# Altium schematic sheet Endurence.SchDoc
size A3
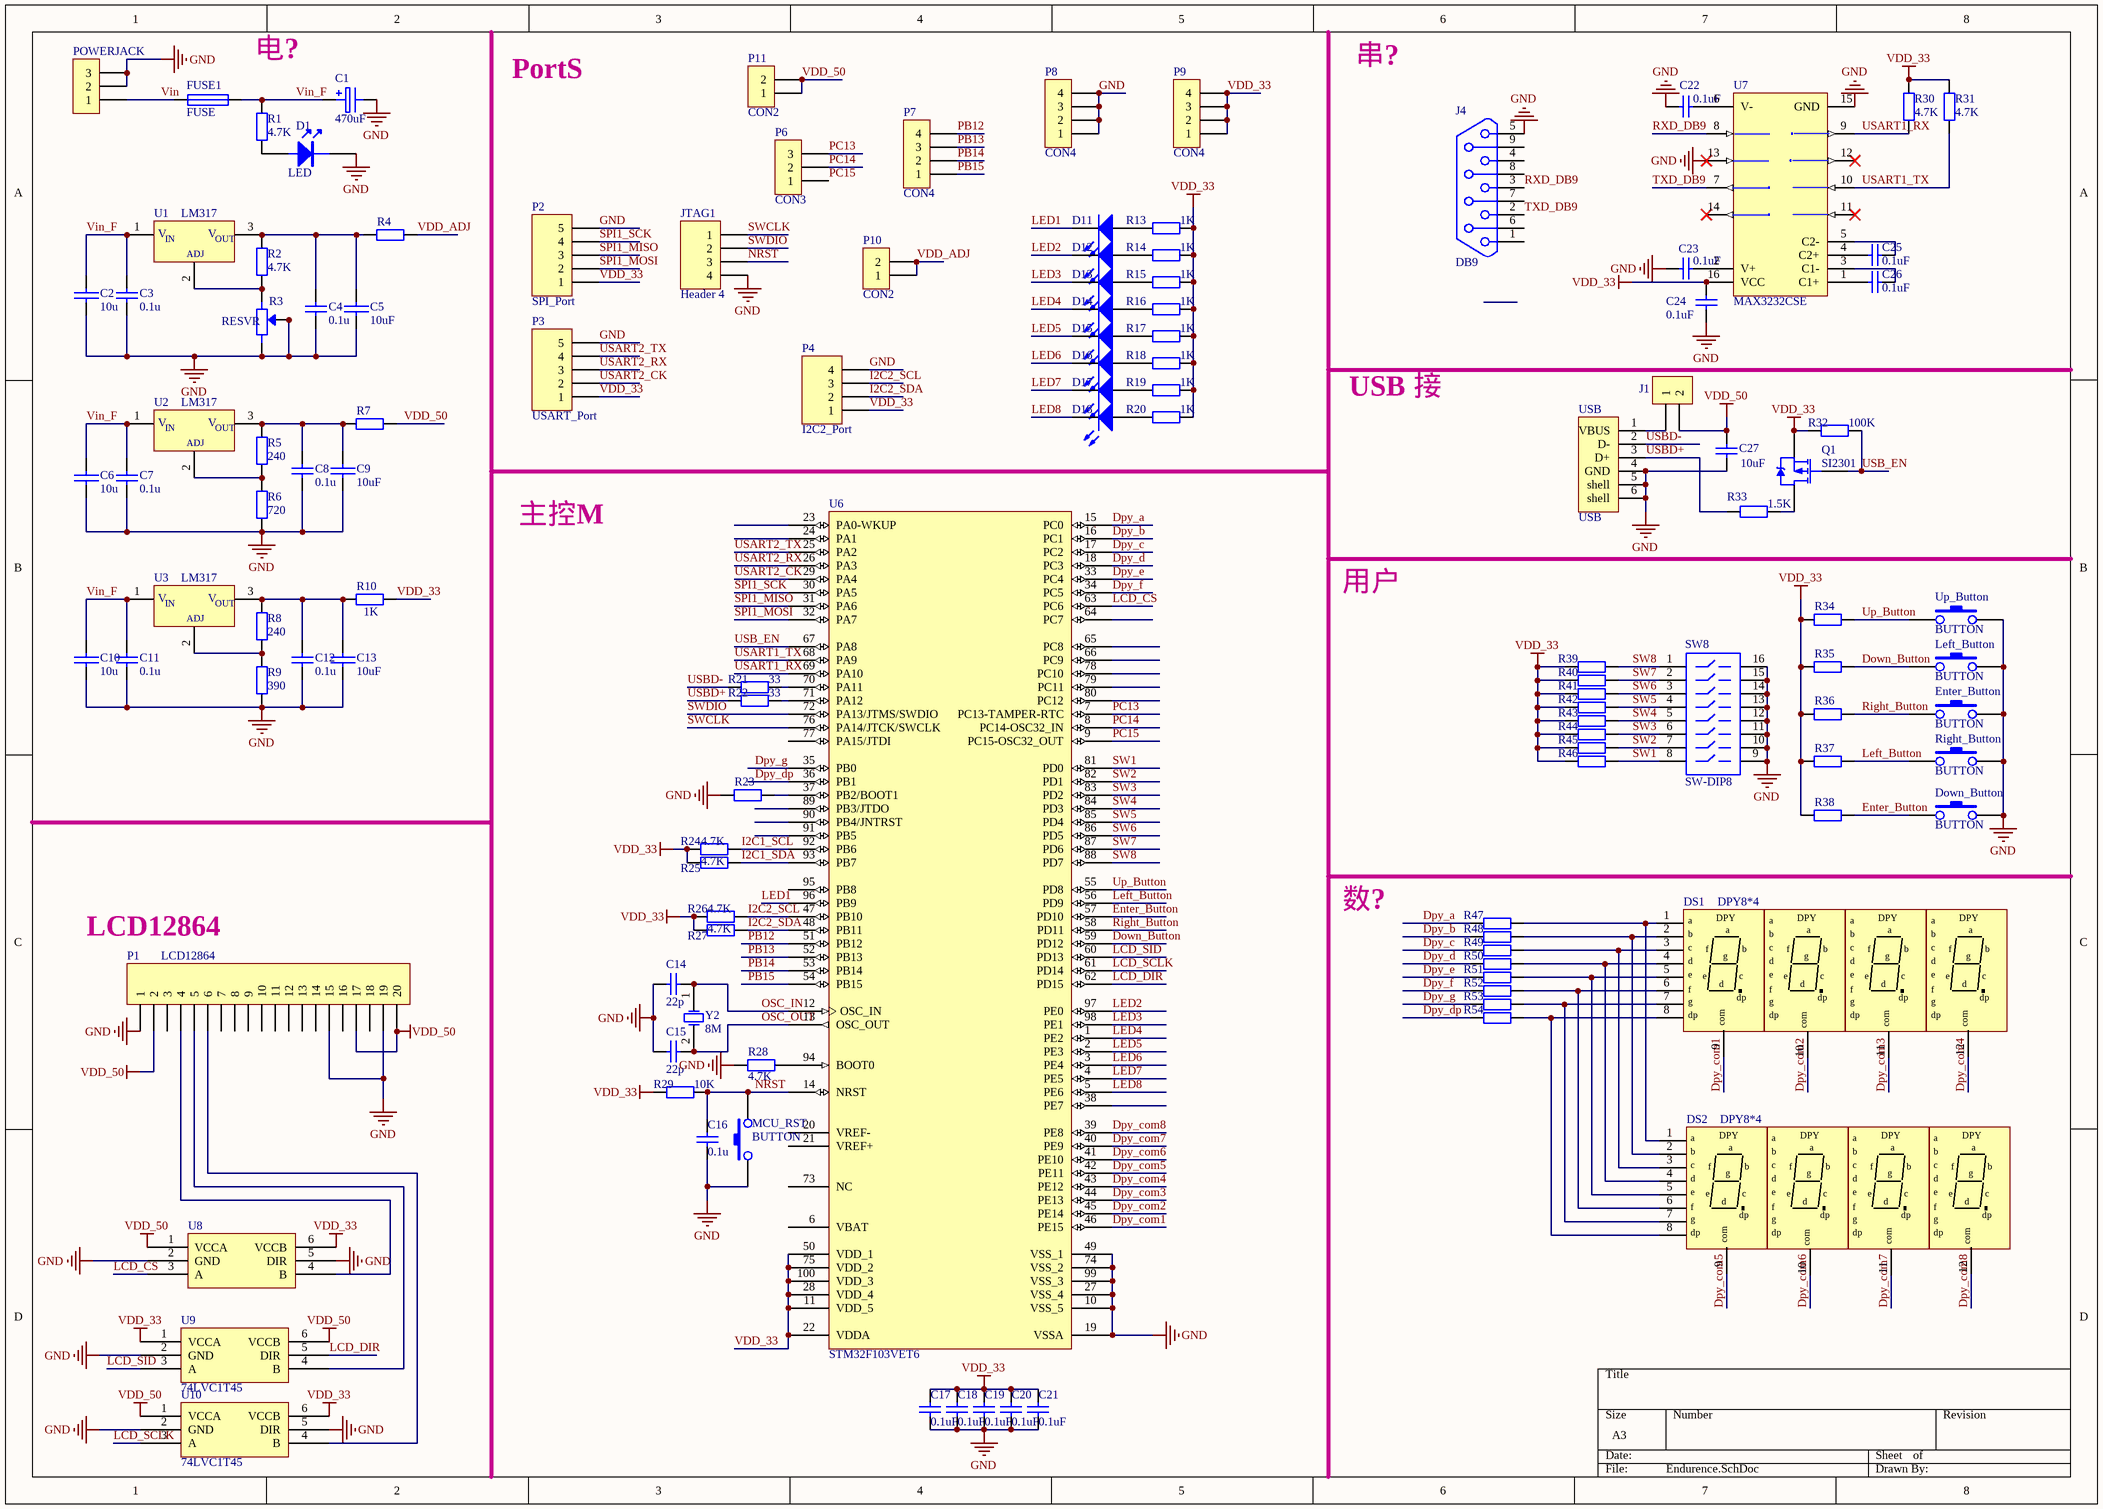
[diagram p0: Endurence.SchDoc]

## Parts
C1  470uF  [MYRB.2/.4]
C2  10u  [0805]
C3  value 0.1u  [0805]  (hidden comment: 0.1uF)
C4  value 0.1u  [0805]  (hidden comment: 0.1uF)
C5  10uF  [0805]
C6  10u  [0805]
C7  value 0.1u  [0805]  (hidden comment: 0.1uF)
C8  value 0.1u  [0805]  (hidden comment: 0.1uF)
C9  10uF  [0805]
C10  10u  [0805]
C11  value 0.1u  [0805]  (hidden comment: 0.1uF)
C12  value 0.1u  [0805]  (hidden comment: 0.1uF)
C13  10uF  [0805]
C14  value 22p  [0805]  (hidden comment: 20pF)
C15  value 22p  [0805]  (hidden comment: 20pF)
C16  value 0.1u  [0805]  (hidden comment: 0.1uF)
C17  0.1uF  [0805]
C18  0.1uF  [0805]
C19  0.1uF  [0805]
C20  0.1uF  [0805]
C21  0.1uF  [0805]
C22  0.1uF  [0805]
C23  0.1uF  [0805]
C24  0.1uF  [0805]
C25  0.1uF  [0805]
C26  0.1uF  [0805]
C27  10uF  [0805]
D1  LED  [0805]
D11  LED2  [0805]  (value not drawn)
D12  LED2  [0805]  (value not drawn)
D13  LED2  [0805]  (value not drawn)
D14  LED2  [0805]  (value not drawn)
D15  LED2  [0805]  (value not drawn)
D16  LED2  [0805]  (value not drawn)
D17  LED2  [0805]  (value not drawn)
D18  LED2  [0805]  (value not drawn)
Down_Button  BUTTON  [BUTTON-S]
DS1  DPY8*4  [DYP8*4]
DS2  DPY8*4  [DYP8*4]
Enter_Button  BUTTON  [BUTTON-S]
FUSE1  FUSE  [FUSE]
J1  CON2  [SIP2]  (value not drawn)
J4  DB9  [DB9]
JTAG1  Header 4  [HDR1X4]
Left_Button  BUTTON  [BUTTON-S]
MCU_RST  BUTTON  [BUTTON-S]
P1  LCD12864  [LCD12864]
P2  SPI_Port  [HDR1X5]
P3  USART_Port  [HDR1X5]
P4  I2C2_Port  [HDR1X4]
P6  CON3  [SIP3]
P7  CON4  [SIP4]
P8  CON4  [SIP4]
P9  CON4  [SIP4]
P10  CON2  [SIP2]
P11  CON2  [SIP2]
POWERJACK  CON3  [POWERJACK]  (value not drawn)
Q1  SI2301  [SOT-23-2301]
R1  4.7K  [0805]
R2  4.7K  [0805]
R3  RESVR  [SIP3]
R4  1K  [0805]  (value not drawn)
R5  240  [0805]
R6  720  [0805]
R7  1K  [0805]  (value not drawn)
R8  240  [0805]
R9  390  [0805]
R10  1K  [0805]
R13  1K  [0805]
R14  1K  [0805]
R15  1K  [0805]
R16  1K  [0805]
R17  1K  [0805]
R18  1K  [0805]
R19  1K  [0805]
R20  1K  [0805]
R21  33  [0805]
R22  33  [0805]
R23  4.7K  [0805]  (value not drawn)
R24  4.7K  [0805]
R25  4.7K  [0805]
R26  4.7K  [0805]
R27  4.7K  [0805]
R28  4.7K  [0805]
R29  10K  [0805]
R30  4.7K  [0805]
R31  4.7K  [0805]
R32  100K  [0805]
R33  1.5K  [0805]
R34  4.7K  [0805]  (value not drawn)
R35  4.7K  [0805]  (value not drawn)
R36  4.7K  [0805]  (value not drawn)
R37  4.7K  [0805]  (value not drawn)
R38  4.7K  [0805]  (value not drawn)
R39  4.7K  [0805]  (value not drawn)
R40  4.7K  [0805]  (value not drawn)
R41  4.7K  [0805]  (value not drawn)
R42  4.7K  [0805]  (value not drawn)
R43  4.7K  [0805]  (value not drawn)
R44  4.7K  [0805]  (value not drawn)
R45  4.7K  [0805]  (value not drawn)
R46  4.7K  [0805]  (value not drawn)
R47  1K  [0805]  (value not drawn)
R48  1K  [0805]  (value not drawn)
R49  1K  [0805]  (value not drawn)
R50  1K  [0805]  (value not drawn)
R51  1K  [0805]  (value not drawn)
R52  1K  [0805]  (value not drawn)
R53  1K  [0805]  (value not drawn)
R54  1K  [0805]  (value not drawn)
Right_Button  BUTTON  [BUTTON-S]
SW8  SW-DIP8  [SW8]
U1  LM317  [LM317]
U2  LM317  [LM317]
U3  LM317  [LM317]
U6  STM32F103VET6  [LQFP100]
U7  MAX3232CSE  [SSOP16]
U8  74LVC1T45  [74LVC1T45]  (value not drawn)
U9  74LVC1T45  [74LVC1T45]
U10  74LVC1T45  [74LVC1T45]
Up_Button  BUTTON  [BUTTON-S]
USB  USB  [USB-B]
Y2  8M  [XTAL-0.2]

## Nets
GND: C1.2 C2.2 C3.1 C4.1 C5.2 C6.2 C7.1 C8.1 C9.2 C10.2 C11.1 C12.1 C13.2 C14.2 C15.2 C16.1 C17.1 C18.1 C19.1 C20.1 C21.1 C22.2 C23.2 C24.1 C27.1 D1.2(K) Down_Button.2 Enter_Button.2 J4.5 JTAG1.4 Left_Button.2 MCU_RST.1 P1.1 P1.15 P1.19 P2.5 P3.5 P4.4 P8.1 P8.2 P8.3 P8.4 POWERJACK.2 POWERJACK.3 R3.2 R3.3(W) R6.1 R9.1 R23.2 R28.2 Right_Button.2 SW8.9 SW8.10 SW8.11 SW8.12 SW8.13 SW8.14 SW8.15 SW8.16 U6.10(VSS_5) U6.19(VSSA) U6.27(VSS_4) U6.49(VSS_1) U6.74(VSS_2) U6.99(VSS_3) U7.13(R1IN) U7.15(GND) U8.2(GND) U8.5(DIR) U9.2(GND) U10.2(GND) U10.5(DIR) Up_Button.2 USB.4(GND) USB.5(shell) USB.6(shell)
VDD_33: C17.2 C18.2 C19.2 C20.2 C21.2 C24.2 P2.1 P3.1 P4.1 P9.1 P9.2 P9.3 P9.4 Q1.3(S) R10.2 R13.2 R14.1 R15.2 R16.2 R17.2 R18.1 R19.2 R20.2 R24.2 R25.2 R26.2 R27.2 R29.1 R30.2 R31.2 R32.1 R34.1 R35.1 R36.1 R37.1 R38.1 R39.1 R40.1 R41.1 R42.1 R43.1 R44.1 R45.1 R46.1 U6.11(VDD_5) U6.22(VDDA) U6.28(VDD_4) U6.50(VDD_1) U6.75(VDD_2) U6.100(VDD_3) U7.16(VCC) U8.6(VCCB) U9.1(VCCA) U10.6(VCCB)
VDD_50: C27.2 J1.2 P1.2 P1.17 P1.20 P11.1 P11.2 R7.2 U8.1(VCCA) U9.6(VCCB) U10.1(VCCA)
Down_Button: Left_Button.1 R35.2 U6.59(PD12)
Dpy_a: R47.1 U6.15(PC0)
Dpy_b: R48.1 U6.16(PC1)
Dpy_c: R49.1 U6.17(PC2)
Dpy_com1: DS1.9(com1) U6.46(PE15)
Dpy_com2: DS1.10(com2) U6.45(PE14)
Dpy_com3: DS1.11(com3) U6.44(PE13)
Dpy_com4: DS1.12(com4) U6.43(PE12)
Dpy_com5: DS2.9(com1) U6.42(PE11)
Dpy_com6: DS2.10(com2) U6.41(PE10)
Dpy_com7: DS2.11(com3) U6.40(PE9)
Dpy_com8: DS2.12(com4) U6.39(PE8)
Dpy_d: R50.1 U6.18(PC3)
Dpy_dp: R54.1 U6.36(PB1)
Dpy_e: R51.1 U6.33(PC4)
Dpy_f: R52.1 U6.34(PC5)
Dpy_g: R53.1 U6.35(PB0)
Enter_Button: Down_Button.1 R38.2 U6.57(PD10)
I2C1_SCL: R24.1 U6.92(PB6)
I2C1_SDA: R25.1 U6.93(PB7)
I2C2_SCL: P4.3 R26.1 U6.47(PB10)
I2C2_SDA: P4.2 R27.1 U6.48(PB11)
LCD_CS: U6.63(PC6) U8.3(A)
LCD_DIR: U6.62(PD15) U9.5(DIR)
LCD_SCLK: U6.61(PD14) U10.3(A)
LCD_SID: U6.60(PD13) U9.3(A)
LED1: D11.2(K) U6.96(PB9)
LED2: D12.2(K) U6.97(PE0)
LED3: D13.2(K) U6.98(PE1)
LED4: D14.2(K) U6.1(PE2)
LED5: D15.2(K) U6.2(PE3)
LED6: D16.2(K) U6.3(PE4)
LED7: D17.2(K) U6.4(PE5)
LED8: D18.2(K) U6.5(PE6)
Left_Button: R37.2 Right_Button.1 U6.56(PD9)
NRST: C16.2 JTAG1.3 MCU_RST.2 R29.2 U6.14(NRST)
OSC_IN: C14.1 U6.12(OSC_IN) Y2.1(OSC1)
OSC_OUT: C15.1 U6.13(OSC_OUT) Y2.2(OSC2)
PB12: P7.4 U6.51(PB12)
PB13: P7.3 U6.52(PB13)
PB14: P7.2 U6.53(PB14)
PB15: P7.1 U6.54(PB15)
PC13: P6.3 U6.7(PC13-TAMPER-RTC)
PC14: P6.2 U6.8(PC14-OSC32_IN)
PC15: P6.1 U6.9(PC15-OSC32_OUT)
Right_Button: Enter_Button.1 R36.2 U6.58(PD11)
RXD_DB9: J4.3 U7.8(R2IN)
SPI1_MISO: P2.3 U6.31(PA6)
SPI1_MOSI: P2.2 U6.32(PA7)
SPI1_SCK: P2.4 U6.30(PA5)
SW1: R46.2 SW8.8 U6.81(PD0)
SW2: R45.2 SW8.7 U6.82(PD1)
SW3: R44.2 SW8.6 U6.83(PD2)
SW4: R43.2 SW8.5 U6.84(PD3)
SW5: R42.2 SW8.4 U6.85(PD4)
SW6: R41.2 SW8.3 U6.86(PD5)
SW7: R40.2 SW8.2 U6.87(PD6)
SW8: R39.2 SW8.1 U6.88(PD7)
SWCLK: JTAG1.1 U6.76(PA14/JTCK/SWCLK)
SWDIO: JTAG1.2 U6.72(PA13/JTMS/SWDIO)
TXD_DB9: J4.2 U7.7(T2OUT)
Up_Button: R34.2 U6.55(PD8) Up_Button.1
USART1_RX: R30.1 U6.69(PA10) U7.9(R2OUT)
USART1_TX: R31.1 U6.68(PA9) U7.10(T2IN)
USART2_CK: P3.2 U6.29(PA4)
USART2_RX: P3.3 U6.26(PA3)
USART2_TX: P3.4 U6.25(PA2)
USB_EN: Q1.1(G) R32.2 U6.67(PA8)
USBD+: R22.1 R33.1 USB.3(D+)
USBD-: R21.1 USB.2(D-)
VDD_ADJ: P10.1 P10.2 R4.2
Vin: FUSE1.1 POWERJACK.1
Vin_F: C1.1 C2.1 C3.2 C6.1 C7.2 C10.1 C11.2 FUSE1.2 R1.1 U1.1(VIN) U2.1(VIN) U3.1(VIN)
NetC4_2: C4.2 C5.1 R2.1 R4.1 U1.3(VOUT)
NetC8_2: C8.2 C9.1 R5.1 R7.1 U2.3(VOUT)
NetC12_2: C12.2 C13.1 R8.1 R10.1 U3.3(VOUT)
NetC22_1: C22.1 U7.6(V-)
NetC23_1: C23.1 U7.2(V+)
NetC25_1: C25.1 U7.5(C2-)
NetC25_2: C25.2 U7.4(C2+)
NetC26_1: C26.1 U7.3(C1-)
NetC26_2: C26.2 U7.1(C1+)
NetD1_1: D1.1(A) R1.2
NetD11_1: D11.1(A) R13.1
NetD12_1: D12.1(A) R14.2
NetD13_1: D13.1(A) R15.1
NetD14_1: D14.1(A) R16.1
NetD15_1: D15.1(A) R17.1
NetD16_1: D16.1(A) R18.2
NetD17_1: D17.1(A) R19.1
NetD18_1: D18.1(A) R20.1
NetDS1_1: DS1.1(a) DS2.1(a) R47.2
NetDS1_2: DS1.2(b) DS2.2(b) R48.2
NetDS1_3: DS1.3(c) DS2.3(c) R49.2
NetDS1_4: DS1.4(d) DS2.4(d) R50.2
NetDS1_5: DS1.5(e) DS2.5(e) R51.2
NetDS1_6: DS1.6(f) DS2.6(f) R52.2
NetDS1_7: DS1.7(g) DS2.7(g) R53.2
NetDS1_8: DS1.8(dp) DS2.8(dp) R54.2
NetJ1_1: J1.1 USB.1(VBUS)
NetP1_4: P1.4 U8.4(B)
NetP1_5: P1.5 U9.4(B)
NetP1_6: P1.6 U10.4(B)
NetQ1_2: Q1.2(D) R33.2
NetR2_2: R2.2 R3.1 U1.2(ADJ)
NetR5_2: R5.2 R6.2 U2.2(ADJ)
NetR8_2: R8.2 R9.2 U3.2(ADJ)
NetR21_2: R21.2 U6.70(PA11)
NetR22_2: R22.2 U6.71(PA12)
NetR23_1: R23.1 U6.37(PB2/BOOT1)
NetR28_1: R28.1 U6.94(BOOT0)

Not connected (* = marked no-connect by the designer): J4 1 4 6 7 8 9; P1 3 7 8 9 10 11 12 13 14 16 18; U6 6(VBAT) 20(VREF-) 21(VREF+) 23(PA0-WKUP) 24(PA1) 38(PE7) 64(PC7) 65(PC8) 66(PC9) 73(NC) 77(PA15/JTDI) 78(PC10) 79(PC11) 80(PC12) 89(PB3/JTDO) 90(PB4/JNTRST) 91(PB5) 95(PB8); U7 11(T1IN)* 12(R1OUT)* 14(T1OUT)*

## Notes on the sheet
- 电?
- PortS
- 串?
- USB 接
- 主控M
- 用户
- 数?
- LCD12864
- (in symbol DPY_7-SEG_DP_4) DPY; com
- (in symbol LM317) V; IN; OUT

## Library data of the parts
C1 = ELECTRO1
C2 C5 C6 C9 C10 C13 = CAP
C3 C4 C7 C8 C11 C12 C14-C21 C27 = Cap: Capacitor; Published: 8-Jun-2000; LatestRevisionDate: 17-Jul-2002; LatestRevisionNote: Re-released for DXP Platform.; Publisher: Altium Limited
  C3 C4 C7 C8 C11 C12 C14-C16: PackageReference: RAD-0.3
  C17-C21: PackageReference: RAD-0.3; Value: 0.1uF
  C27: PackageReference: 0805; Value: 10uF
C22-C26 = C: Capacitor
D11-D18 = LED2: Typical RED, GREEN, YELLOW, AMBER GaAs LED; Published: 8-Jun-2000; LatestRevisionDate: 17-Jul-2002; LatestRevisionNote: Re-released for DXP Platform.; PackageDocument: Feb-2002; PackageReference: 3.2X1.6X1.1; Publisher: Altium Limited
Down_Button Enter_Button Left_Button Up_Button = BUTTON: 乒乓球按键（压下后接通，松开自动断开），较大按键尺寸12mmX12mm选用BUTTON-L封装，较小尺寸6mmX6mm选用BUTTON-S封装
DS1 DS2 = DPY_7-SEG_DP_4
J1 P10 P11 = CON2: Connector
J4 = DB9: 标准DB9芯连接器，多用于串口连接，使用母型接口DB9RA/F,公型接口DB9RA/M
JTAG1 P4 = Header 4: Header, 4-Pin; LatestRevisionDate: 17-Jul-2002; LatestRevisionNote: Re-released for DXP Platform.; Publisher: Altium Limited
P1 = Header 20: Header, 20-Pin; LatestRevisionDate: 17-Jul-2002; LatestRevisionNote: Re-released for DXP Platform.; Publisher: Altium Limited
P2 P3 = Header 5: Header, 5-Pin; LatestRevisionDate: 17-Jul-2002; LatestRevisionNote: Re-released for DXP Platform.; Publisher: Altium Limited
P6 POWERJACK = CON3: Connector
P7-P9 = CON4: Connector
Q1 = PMOS-2: P-Channel Power MOSFET; pin to pad: 2>3 3>2; Note: Pin 4 not drawn and electrically connected to Pin 2.; Published: 8-Jun-2000; LatestRevisionDate: 17-Jul-2002; LatestRevisionNote: Re-released for DXP Platform.; DatasheetDocument: PD-9.390D; PackageReference: SOT-23-2301; Publisher: Altium Limited; Code_JEDEC: TO-220-AB; ComponentLink1Description: Manufacturer Link; ComponentLink1URL: http://www.irf.com/
R1 R2 R5 R6 R8 R9 R23-R28 R30 R31 = R: 0805
R3 = RESVR: Potentiometer
R4 R7 R10 R13-R22 R29 R32 R33 R47-R54 = Res2: Resistor; Published: 8-Jun-2000; LatestRevisionDate: 17-Jul-2002; LatestRevisionNote: Re-released for DXP Platform.; Publisher: Altium Limited
  R4 R7: PackageReference: AXIAL-0.4; PackageDescription: Axial Device, Thru-Hole; 2 Leads; 0.4 in Pin Spacing
  R10 R47-R54: PackageReference: AXIAL-0.4; PackageDescription: Axial Device, Thru-Hole; 2 Leads; 0.4 in Pin Spacing; Value: 1K
  R13-R20: PackageReference: 0805; Value: 1K
  R21 R22: PackageReference: 0805; Value: 33
  R29: PackageReference: 0805; Value: 10K
  R32: PackageReference: 0805; Value: 100K
  R33: PackageReference: 0805; Value: 1.5K
R34-R46 = Res2: Resistor; Value: 1K; Published: 8-Jun-2000; LatestRevisionDate: 17-Jul-2002; LatestRevisionNote: Re-released for DXP Platform.; PackageReference: AXIAL-0.4; Publisher: Altium Limited; PackageDescription: Axial Device, Thru-Hole; 2 Leads; 0.4 in Pin Spacing
SW8 = SW-DIP8: 4009 Series DIP Switch, Raised actuator; Published: 24-Mar-1999; LatestRevisionDate: 17-Dec-2003; LatestRevisionNote: PCB Footprint replaced.; PackageReference: DIP-16-KEY; Publisher: Altium Limited; PackageDescription: DIP; 16 Leads; Row Spacing 7.62 mm; Pitch 2.54 mm; ComponentLink1Description: Manufacturer Link; ComponentLink1URL: http://www.oupiin.com/prodindx.html#Headers
U1-U3 = LM317: 3-Terminal Adjustable Positive Voltage Regulator
U6 = STM32F103V8T6: STM32 ARM-based 32-bit MCU with 64 Kbytes Flash, 100-pin LQFP, Industrial Temperature; Published: 30-May-2008; DatasheetVersion: rev6, Mar-2008; PackageVersion: Mar-2008; PackageReference: LQFP100; Publisher: Altium Limited; PackageDescription: 100-Pin Low-Profile Quad Flat Pack, 14 x 14 mm Body, 0.5 mm Pitch (LQFP100); ComponentLink1Description: Manufacturer Link; ComponentLink1URL: www.st.com/stm32; ComponentLink2Description: Datasheet; ComponentLink2URL: http://www.st.com/stonline/products/literature/ds/13587.pdf
U7 = MAX3232CSE: 3.0V TO 5.5V, Low-Power, up to 1Mbps, True RS-232 Transceiver Using Four 0.1µF External Capacitor; Published: 16-Jan-2001; LatestRevisionDate: 13-Apr-2006; LatestRevisionNote: IPC-7351 Footprint Added.; DatasheetVersion: Mar-1999; PackageReference: NSO16; Publisher: Altium Limited; PackageDescription: 16-Pin Small Outline Integrated Circuit 1.27 mm Pitch; Code_JEDEC: MS-012-AC; Code_IPC: SOIC127P600-16; ComponentLink1Description: Manufacturer Link; ComponentLink1URL: http://www.maxim-ic.com/; ComponentLink2Description: Datasheet; ComponentLink2URL: http://pdfserv.maxim-ic.com/en/ds/MAX3222-MAX3241.pdf
Y2 = XTAL: Crystal Oscillator; Published: 8-Jun-2000; LatestRevisionDate: 17-Jul-2002; LatestRevisionNote: Re-released for DXP Platform.; PackageReference: XTAL-0.2; Publisher: Altium Limited